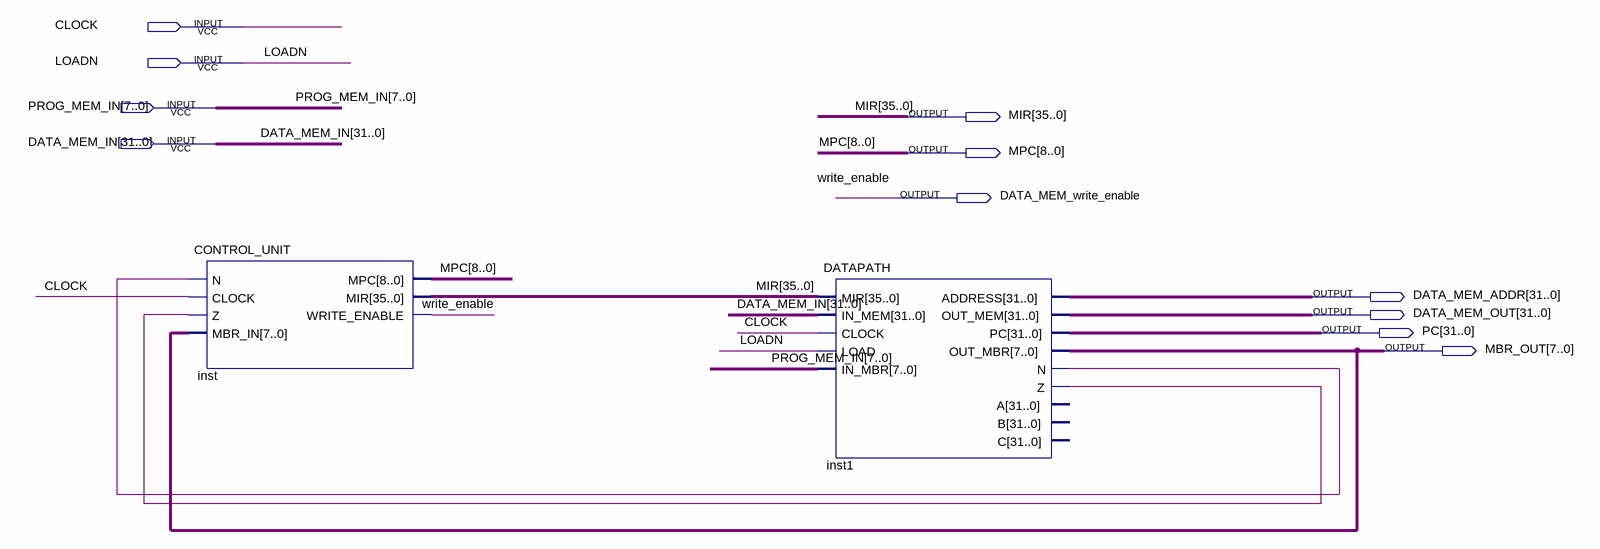
[diagram p0: schematic sheet]
// Quartus schematic CPU2.bdf as structural Verilog: 2 symbols, 11 pins
module CPU2 (
  input  CLOCK,
  input  LOADN,
  input  [7:0] PROG_MEM_IN,
  input  [31:0] DATA_MEM_IN,
  output [35:0] MIR,
  output [8:0] MPC,
  output DATA_MEM_write_enable,
  output [31:0] DATA_MEM_ADDR,
  output [31:0] DATA_MEM_OUT,
  output [31:0] PC,
  output [7:0] MBR_OUT
);

  wire inst1_n, inst1_z;

  CONTROL_UNIT inst (
    .N(inst1_n), .CLOCK(CLOCK), .Z(inst1_z), .MBR_IN(MBR_OUT), .MPC(MPC), .MIR(MIR),
    .WRITE_ENABLE(DATA_MEM_write_enable));
  DATAPATH inst1 (
    .MIR(MIR), .IN_MEM(DATA_MEM_IN), .CLOCK(CLOCK), .LOAD(LOADN), .IN_MBR(PROG_MEM_IN),
    .ADDRESS(DATA_MEM_ADDR), .OUT_MEM(DATA_MEM_OUT), .PC(PC), .OUT_MBR(MBR_OUT), .N(inst1_n), .Z(inst1_z));  // open: A, B, C

  // Other names for the same wires on the sheet: write_enable = DATA_MEM_write_enable
endmodule
